# Altium schematic sheet [04]-OUTPUT.SchDoc
size A4; SheetNumber: 4; SheetTotal: 4
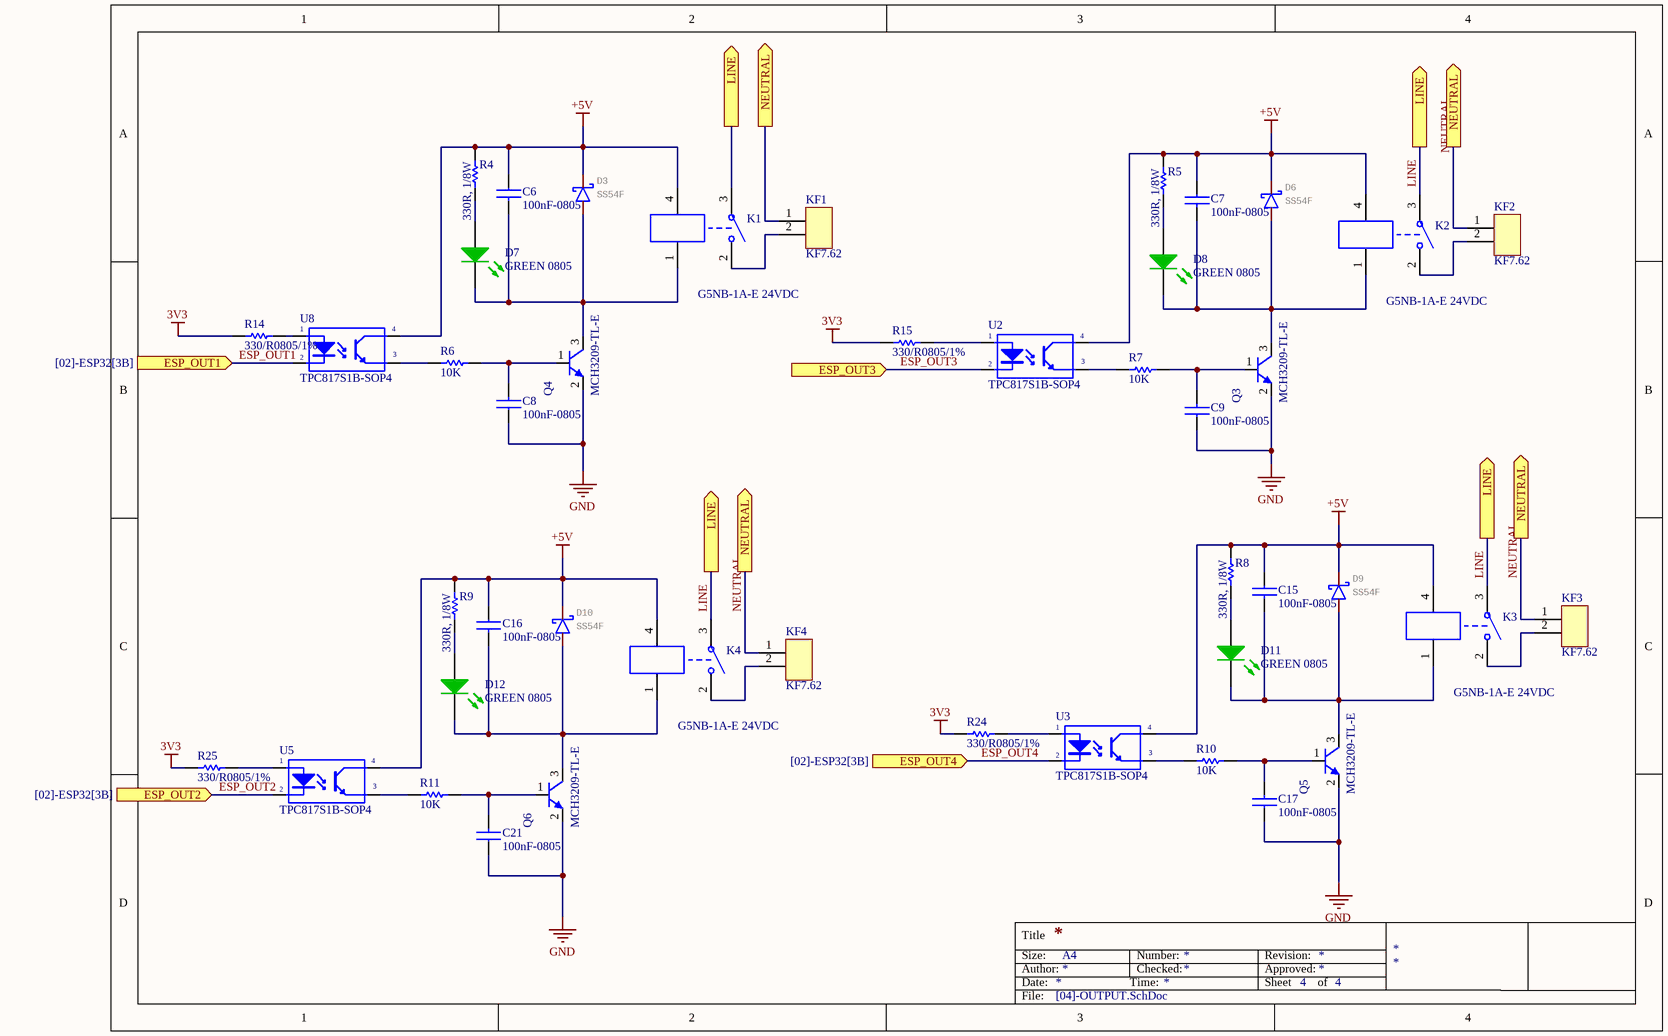
[diagram p0: [04]-OUTPUT.SchDoc]

## Parts
C6  100nF-0805  [CAP0805]
C7  100nF-0805  [CAP0805]
C8  100nF-0805  [CAP0805]
C9  100nF-0805  [CAP0805]
C15  100nF-0805  [CAP0805]
C16  100nF-0805  [CAP0805]
C17  100nF-0805  [CAP0805]
C21  100nF-0805  [CAP0805]
D3  SS54F  [SMAF]
D6  SS54F  [SMAF]
D7  GREEN 0805  [Led 0805G]
D8  GREEN 0805  [Led 0805G]
D9  SS54F  [SMAF]
D10  SS54F  [SMAF]
D11  GREEN 0805  [Led 0805G]
D12  GREEN 0805  [Led 0805G]
K1  G5NB-1A-E 24VDC  [RELAY-G5NB-1A-E 24VDC]
K2  G5NB-1A-E 24VDC  [RELAY-G5NB-1A-E 24VDC]
K3  G5NB-1A-E 24VDC  [RELAY-G5NB-1A-E 24VDC]
K4  G5NB-1A-E 24VDC  [RELAY-G5NB-1A-E 24VDC]
KF1  KF7.62  [KF-7.62]
KF2  KF7.62  [KF-7.62]
KF3  KF7.62  [KF-7.62]
KF4  KF7.62  [KF-7.62]
Q3  MCH3209-TL-E  [MCH3209-TL-E  SOT-323]
Q4  MCH3209-TL-E  [MCH3209-TL-E  SOT-323]
Q5  MCH3209-TL-E  [MCH3209-TL-E  SOT-323]
Q6  MCH3209-TL-E  [MCH3209-TL-E  SOT-323]
R4  value 330R, 1/8W  [RESC2012L]  (hidden comment: CR05JL7-330R)
R5  value 330R, 1/8W  [RESC2012L]  (hidden comment: CR05JL7-330R)
R6  10K  [Res 0805 SMD]
R7  10K  [Res 0805 SMD]
R8  value 330R, 1/8W  [RESC2012L]  (hidden comment: CR05JL7-330R)
R9  value 330R, 1/8W  [RESC2012L]  (hidden comment: CR05JL7-330R)
R10  10K  [Res 0805 SMD]
R11  10K  [Res 0805 SMD]
R14  330/R0805/1%  [Res 0805 SMD]
R15  330/R0805/1%  [Res 0805 SMD]
R24  330/R0805/1%  [Res 0805 SMD]
R25  330/R0805/1%  [Res 0805 SMD]
U2  TPC817S1B-SOP4  [TPC817-4SOP]
U3  TPC817S1B-SOP4  [TPC817-4SOP]
U5  TPC817S1B-SOP4  [TPC817-4SOP]
U8  TPC817S1B-SOP4  [TPC817-4SOP]

## Ports
ESP_OUT1 (in, see [02]-ESP32[3B]), ESP_OUT2 (in, see [02]-ESP32[3B]), ESP_OUT3 (in, see [02]-ESP32[3B]), ESP_OUT4 (in, see [02]-ESP32[3B]), LINE (out, see [01]-POWER[1B], [04]-OUTPUT[2A], [04]-OUTPUT[2C], [04]-OUTPUT[4A]), LINE (out, see [01]-POWER[1B], [04]-OUTPUT[2A], [04]-OUTPUT[2C], [04]-OUTPUT[4C]), LINE (out, see [01]-POWER[1B], [04]-OUTPUT[2A], [04]-OUTPUT[4A], [04]-OUTPUT[4C]), LINE (out, see [01]-POWER[1B], [04]-OUTPUT[2C], [04]-OUTPUT[4A], [04]-OUTPUT[4C]), NEUTRAL (out, see [01]-POWER[1B], [04]-OUTPUT[2A], [04]-OUTPUT[2C], [04]-OUTPUT[4A]), NEUTRAL (out, see [01]-POWER[1B], [04]-OUTPUT[2A], [04]-OUTPUT[2C], [04]-OUTPUT[4C]), NEUTRAL (out, see [01]-POWER[1B], [04]-OUTPUT[2A], [04]-OUTPUT[4A], [04]-OUTPUT[4C]), NEUTRAL (out, see [01]-POWER[1B], [04]-OUTPUT[2C], [04]-OUTPUT[4A], [04]-OUTPUT[4C])

## Nets
3V3: R14.1 R15.1 R24.1 R25.1
+5V: C6.1 C7.1 C15.1 C16.1 D3.C D6.C D9.C D10.C K1.4 K2.4 K3.4 K4.4 R4.2 R5.2 R8.2 R9.2 U2.4(C) U3.4(C) U5.4(C) U8.4(C)
GND: C8.1 C9.1 C17.1 C21.1 Q3.2(E) Q4.2(E) Q5.2(E) Q6.2(E)
ESP_OUT1: U8.2(K) ; port ESP_OUT1
ESP_OUT2: U5.2(K) ; port ESP_OUT2
ESP_OUT3: U2.2(K) ; port ESP_OUT3
ESP_OUT4: U3.2(K) ; port ESP_OUT4
LINE: K1.3(NO) K2.3(NO) K3.3(NO) K4.3(NO) ; port LINE
NEUTRAL: KF1.1 KF2.1 KF3.1 KF4.1 ; port NEUTRAL
NetC6_2: C6.2 D3.A D7.2(K) K1.1(COM) Q4.3(C)
NetC7_2: C7.2 D6.A D8.2(K) K2.1(COM) Q3.3(C)
NetC8_2: C8.2 Q4.1(B) R6.1
NetC9_2: C9.2 Q3.1(B) R7.1
NetC15_2: C15.2 D9.A D11.2(K) K3.1(COM) Q5.3(C)
NetC16_2: C16.2 D10.A D12.2(K) K4.1(COM) Q6.3(C)
NetC17_2: C17.2 Q5.1(B) R10.1
NetC21_2: C21.2 Q6.1(B) R11.1
NetD7_1: D7.1(A) R4.1
NetD8_1: D8.1(A) R5.1
NetD11_1: D11.1(A) R8.1
NetD12_1: D12.1(A) R9.1
NetK1_2: K1.2(NC) KF1.2
NetK2_2: K2.2(NC) KF2.2
NetK3_2: K3.2(NC) KF3.2
NetK4_2: K4.2(NC) KF4.2
NetR6_2: R6.2 U8.3(E)
NetR7_2: R7.2 U2.3(E)
NetR10_2: R10.2 U3.3(E)
NetR11_2: R11.2 U5.3(E)
NetR14_2: R14.2 U8.1(A)
NetR15_2: R15.2 U2.1(A)
NetR24_2: R24.2 U3.1(A)
NetR25_2: R25.2 U5.1(A)

## Notes on the sheet
- Title
- Size:
- Date:
- Author:
- A4
- Time:
- Number:
- Checked:
- Revision:
- Sheet
- Approved:
- of
- File:

## Library data of the parts
C6-C9 C15-C17 C21 = CC0805KRX7R9BB104: CAP CER 0.1UF 50V X7R 0805; Manufacturer: Yageo; Tolerance: ±10%; Notification: Current market demand for these product types have resulted in fluctuating and extending lead times. Lead times may differ.; Supplier 1: Digi-Key; Manufacturer Part Number: CC0805KRX7R9BB104; RoHS: RoHS Compliant; Category: Capacitors; Stock 1: 0; Pricing 1: 1=0.13, 10=0.093, 100=0.0439, 500=0.03076, 1000=0.02547 (USD); Packaging: Cut Tape (CT); Part Status: Active; Voltage - Rated: 50V; Temperature Coefficient: X7R; Operating Temperature: -55°C ~ 125°C; Features: High Voltage; Ratings: -; Applications: General Purpose; Failure Rate: -; Mounting Type: Surface Mount, MLCC; Package / Case: 0805 (2012 Metric); Size / Dimension: 0.079" L x 0.049" W (2.00mm x 1.25mm); Height - Seated (Max): -; Thickness (Max): 0.033" (0.85mm); Lead Spacing: -; Lead Style: -; ComponentLink1URL: http://www.yageo.com/documents/recent/UPY-GPHC_X7R_6.3V-to-50V_18.pdf; ComponentLink1Description: http://www.yageo.com/documents/recent/UPY-GPHC_X7R_6.3V-to-50V_18.pdf; Supplier Part Number 1: 311-1140-1-ND
D3 D6 D9 D10 = SS54F: GateName_1: G$1; SymbolName_1: DIODE_S; LibraryName: Uy_SMD; DeviceSetName: SS54F; Package: SMAF
D7 D8 D11 D12 = LED GREEN 0603: Green 571nm LED Indication - Discrete 2V 0805 (2012 Metric); ComponentLink1URL: http://optoelectronics.liteon.com/upload/download/DS22-2000-074/S_110_LTST-C190KGKT.pdf; ComponentLink1Description: http://optoelectronics.liteon.com/upload/download/DS22-2000-074/S_110_LTST-C190KGKT.pdf; Digikey: 160-1426-1-ND
K1-K4 = Relay-G5NB-1A-E 24VDC: Relay 24VDC SPST-NO General Purpose / Industrial; Published: 24-Mar-1999; LatestRevisionDate: 17-Jul-2002; LatestRevisionNote: Re-released for DXP Platform.; PackageReference: DIP-P8; Publisher: Altium Limited
KF1-KF4 = KF 2P
Q3-Q6 = 2SC1815: Bipolar (BJT) Transistor NPN 30V 3A 450MHz 800mW Surface Mount 3-MCPH; ComponentLink1Description: Datasheet; ComponentLink1URL: D:\Dropbox\Datasheets\Transistors\P Channel Bipolar\2SC1815.pdf; Digikey: MCH3209-TL-EOSCT-ND
R4 R5 R8 R9 = CR05JL7-330R: RES CR 0805 5% 1/8W 330R; Unit Price: 0.000802; ComponentLink1Description: Datasheet; ComponentLink1URL: D:\Dropbox\Datasheets\Passive Components\Resistors\Thick Film Chip Resistor CR.pdf
R6 R7 R10 R11 R14 R15 R24 R25 = 249K/R0805/1%: RES SMD 249K OHM 1% 1/10W 0805; Manufacturer: Yageo; Manufacturer Part Number: RC0603FR-07249KL; Power (Watts): 0.1W, 1/10W; Temperature Coefficient: ±100ppm/°C; Supplier 1: Digi-Key; RoHS: RoHS Compliant; Category: Resistors; Stock 1: 370515; Pricing 1: 1=0.1, 10=0.015, 100=0.006, 1000=0.00268, 2500=0.00233 (USD); Packaging: Cut Tape (CT); Part Status: Active; Tolerance: ±1%; Composition: Thick Film; Features: Moisture Resistant; Operating Temperature: -55°C ~ 155°C; Package / Case: 0603 (1608 Metric); Supplier Device Package: 0603; Size / Dimension: 0.063" L x 0.032" W (1.60mm x 0.80mm); Height - Seated (Max): 0.022" (0.55mm); Failure Rate: -; ComponentLink1URL: http://www.yageo.com/documents/recent/PYu-RC_Group_51_RoHS_L_8.pdf; ComponentLink1Description: http://www.yageo.com/documents/recent/PYu-RC_Group_51_RoHS_L_8.pdf
U2 U3 U5 U8 = PC817: Optoisolator Transistor Output 5000Vrms 1 Channel 4-SOP; Digikey: TPC817S1BRAGCT-ND